# EasyEDA schematic SCH_FinalThesis.json

## Sheets
1 Main: TITLE: ESP32 Interface; REV: 1.0; Date: 2023-12-31; Sheet: 1/3; Drawn By: Guillem Senabre; Company: NCU, UPC
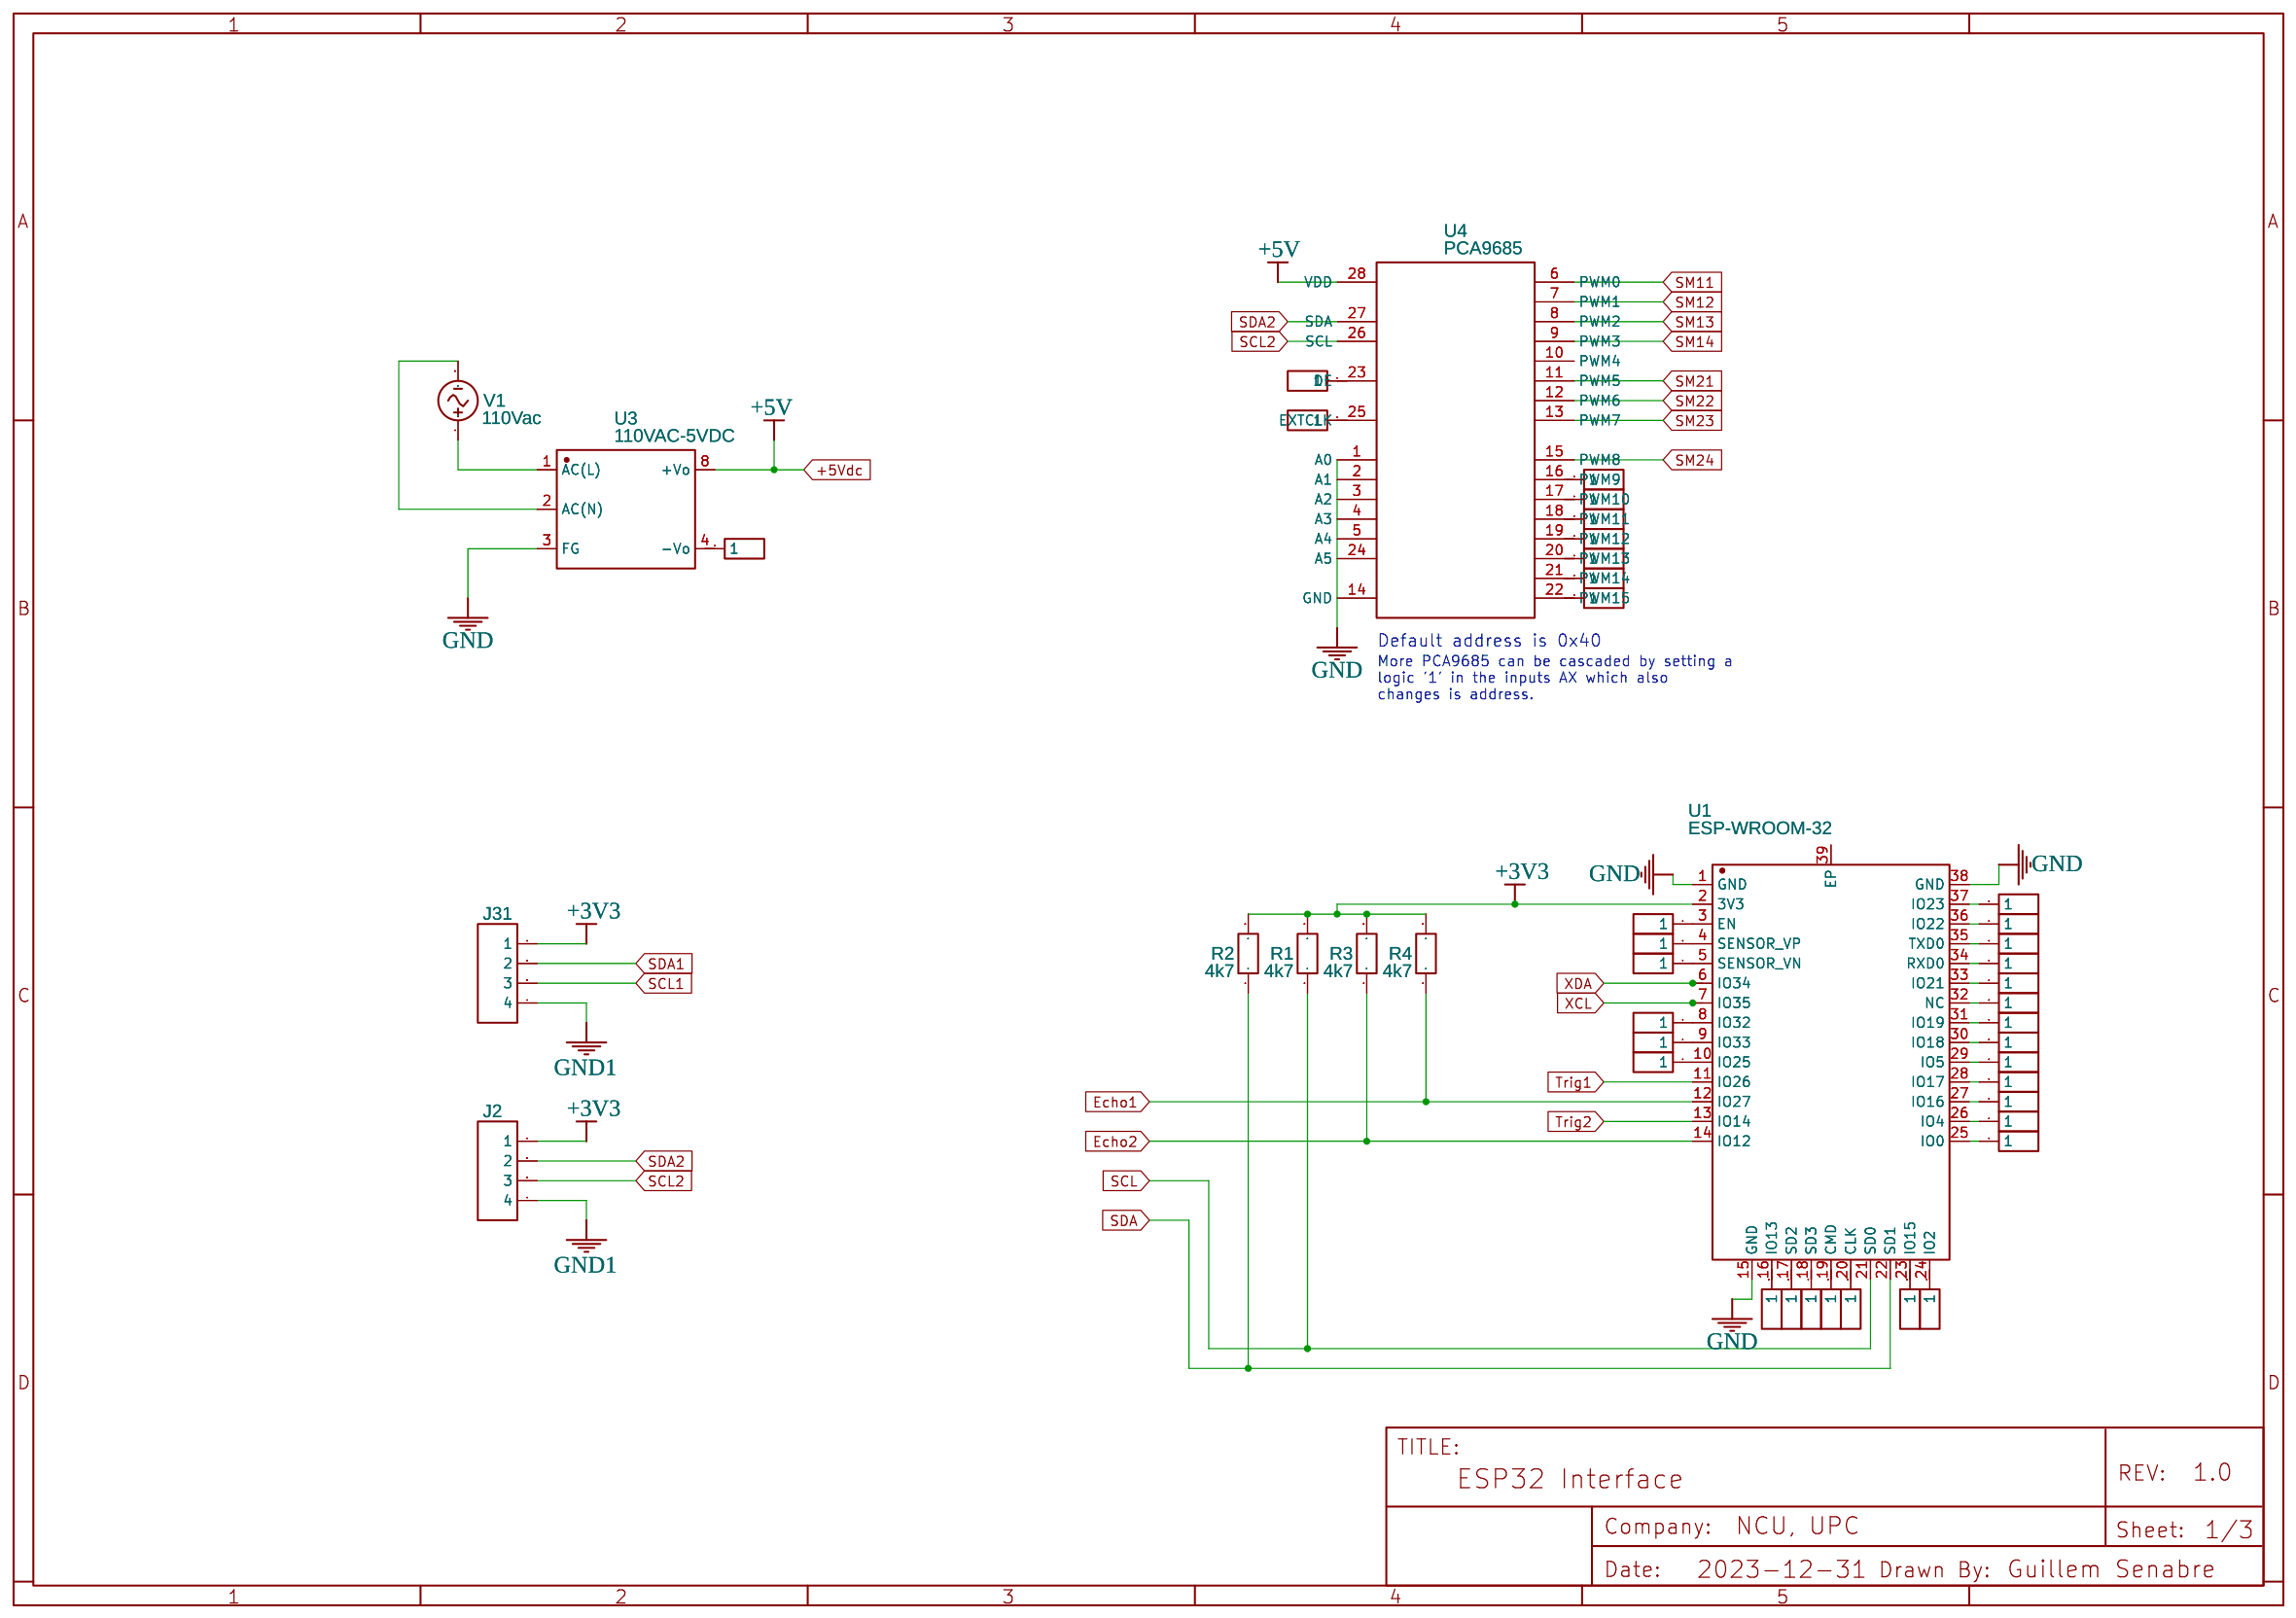
[diagram p0: Main]
2 Sensors: TITLE: Sensors; Sheet: 2/3
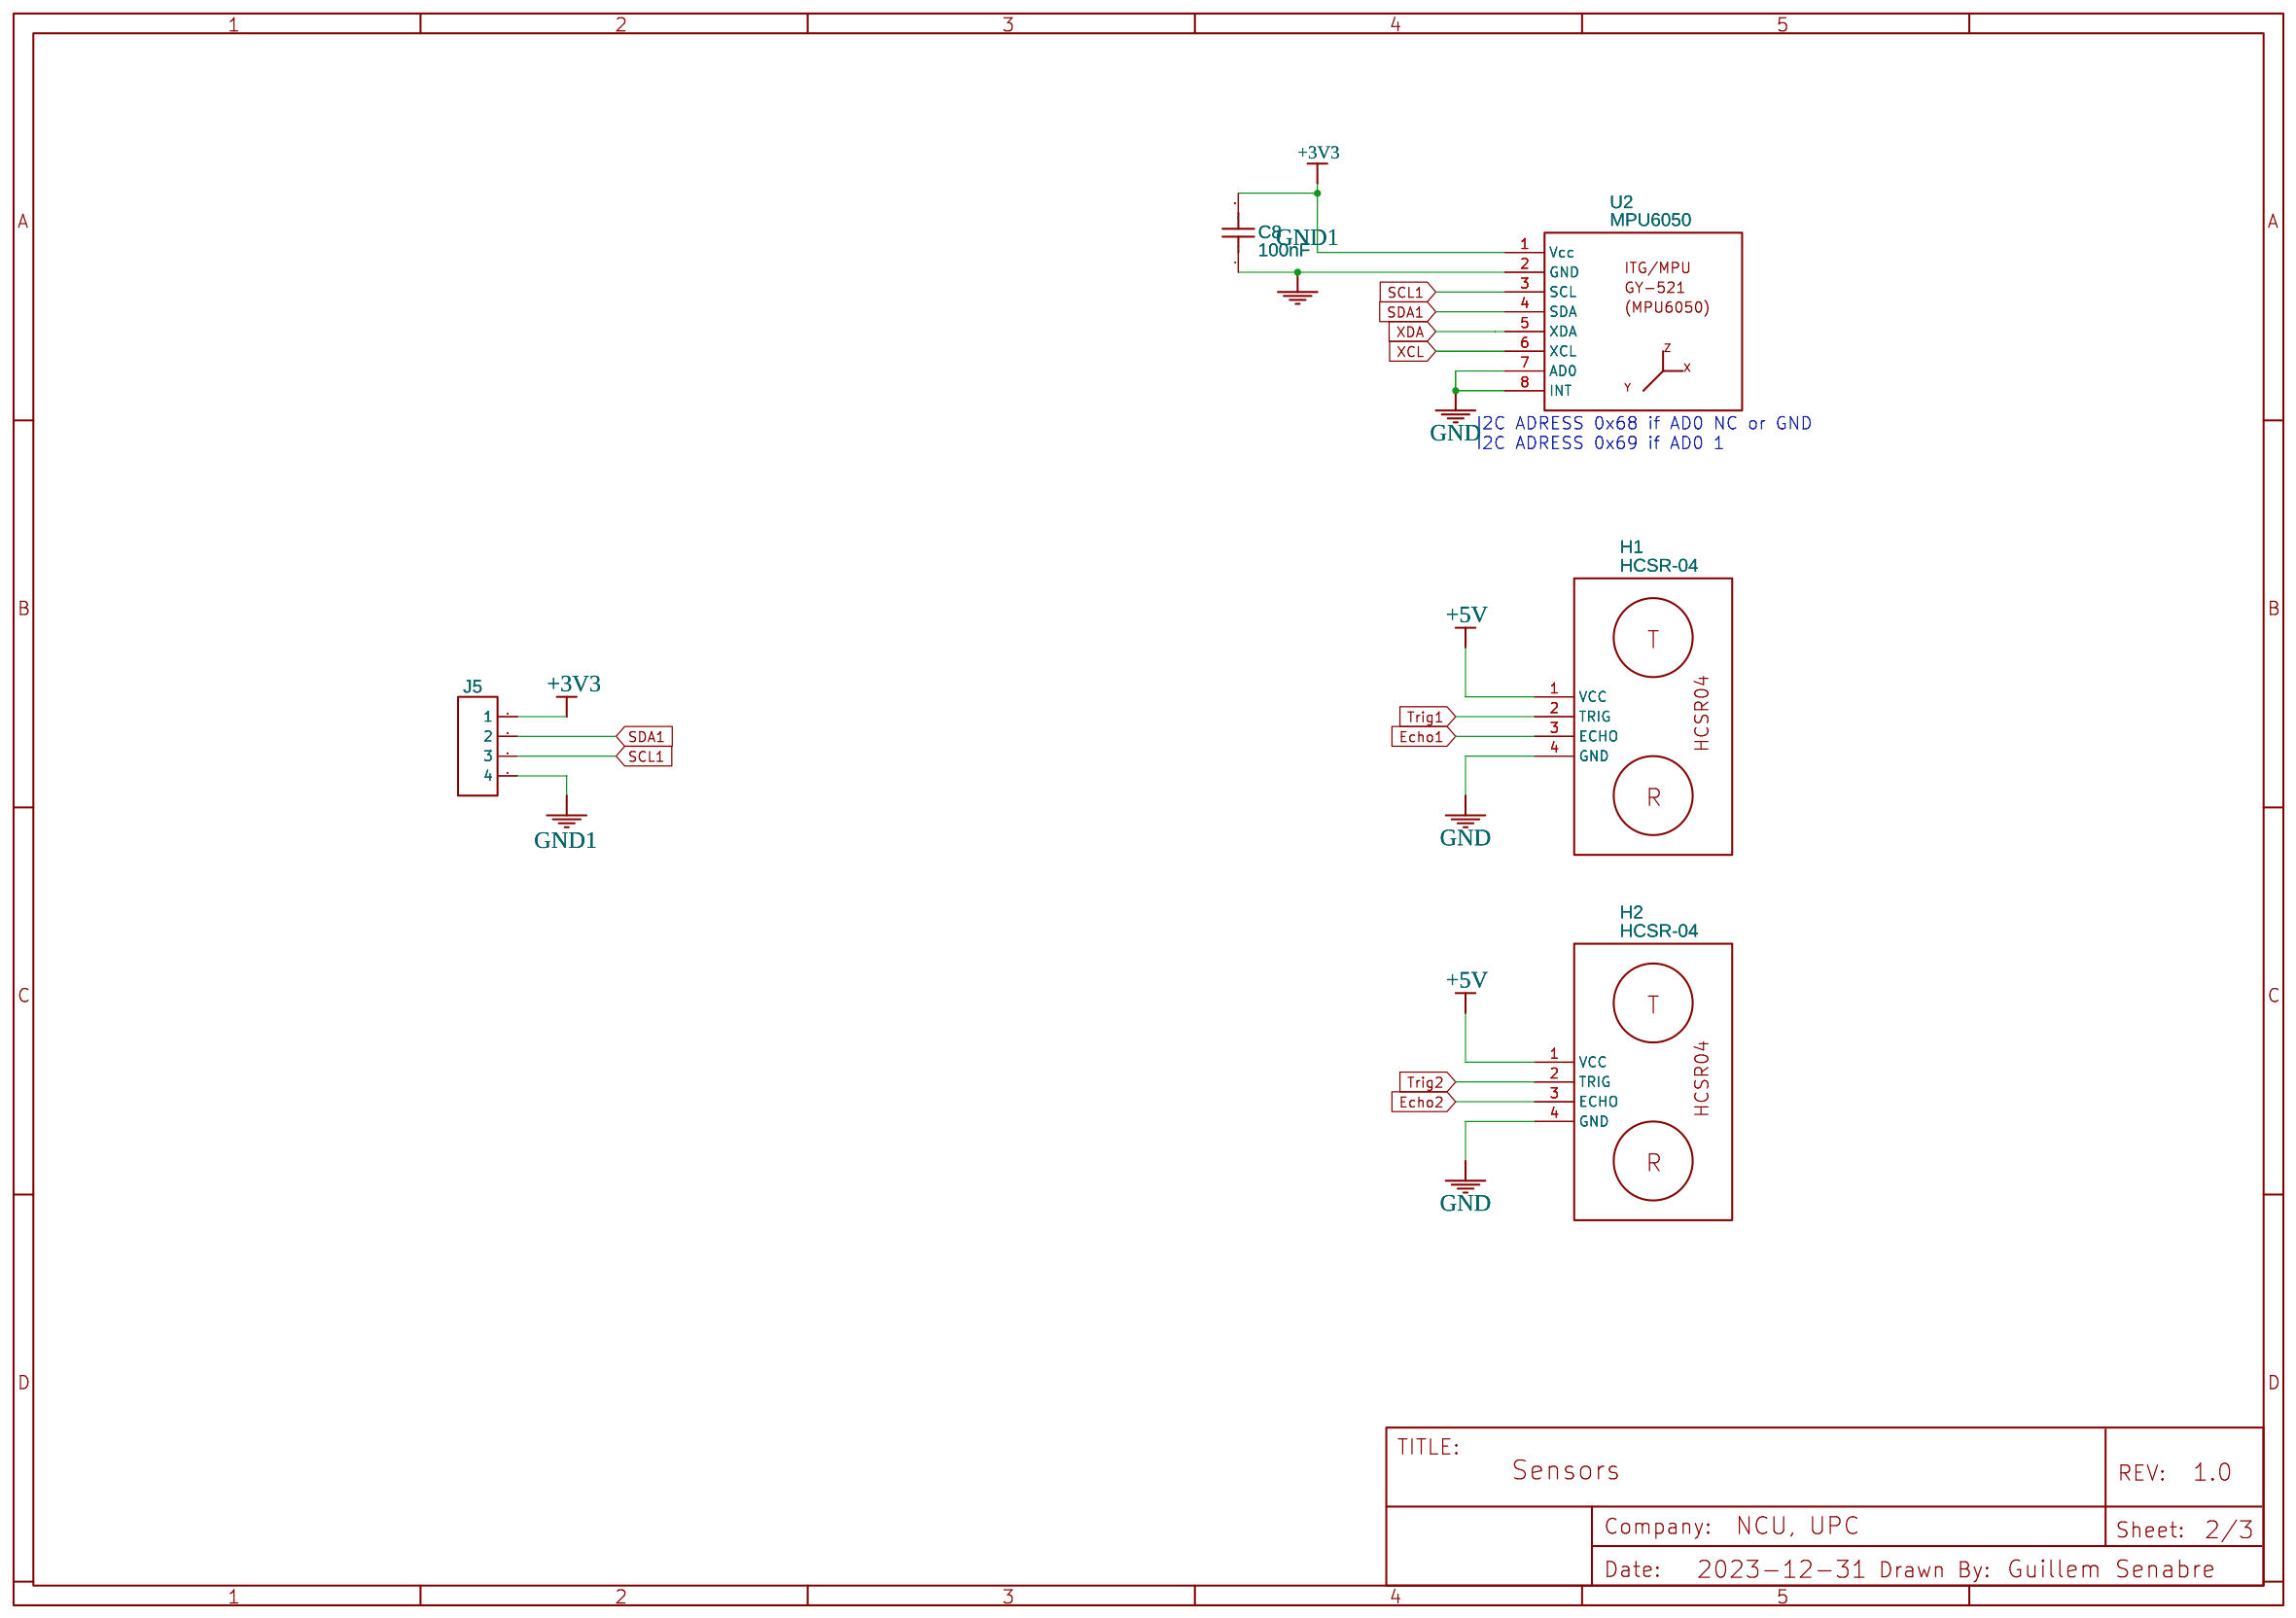
[diagram p1: Sensors]
3 Actuators: TITLE: Servo Motors MG996R; Sheet: 3/3
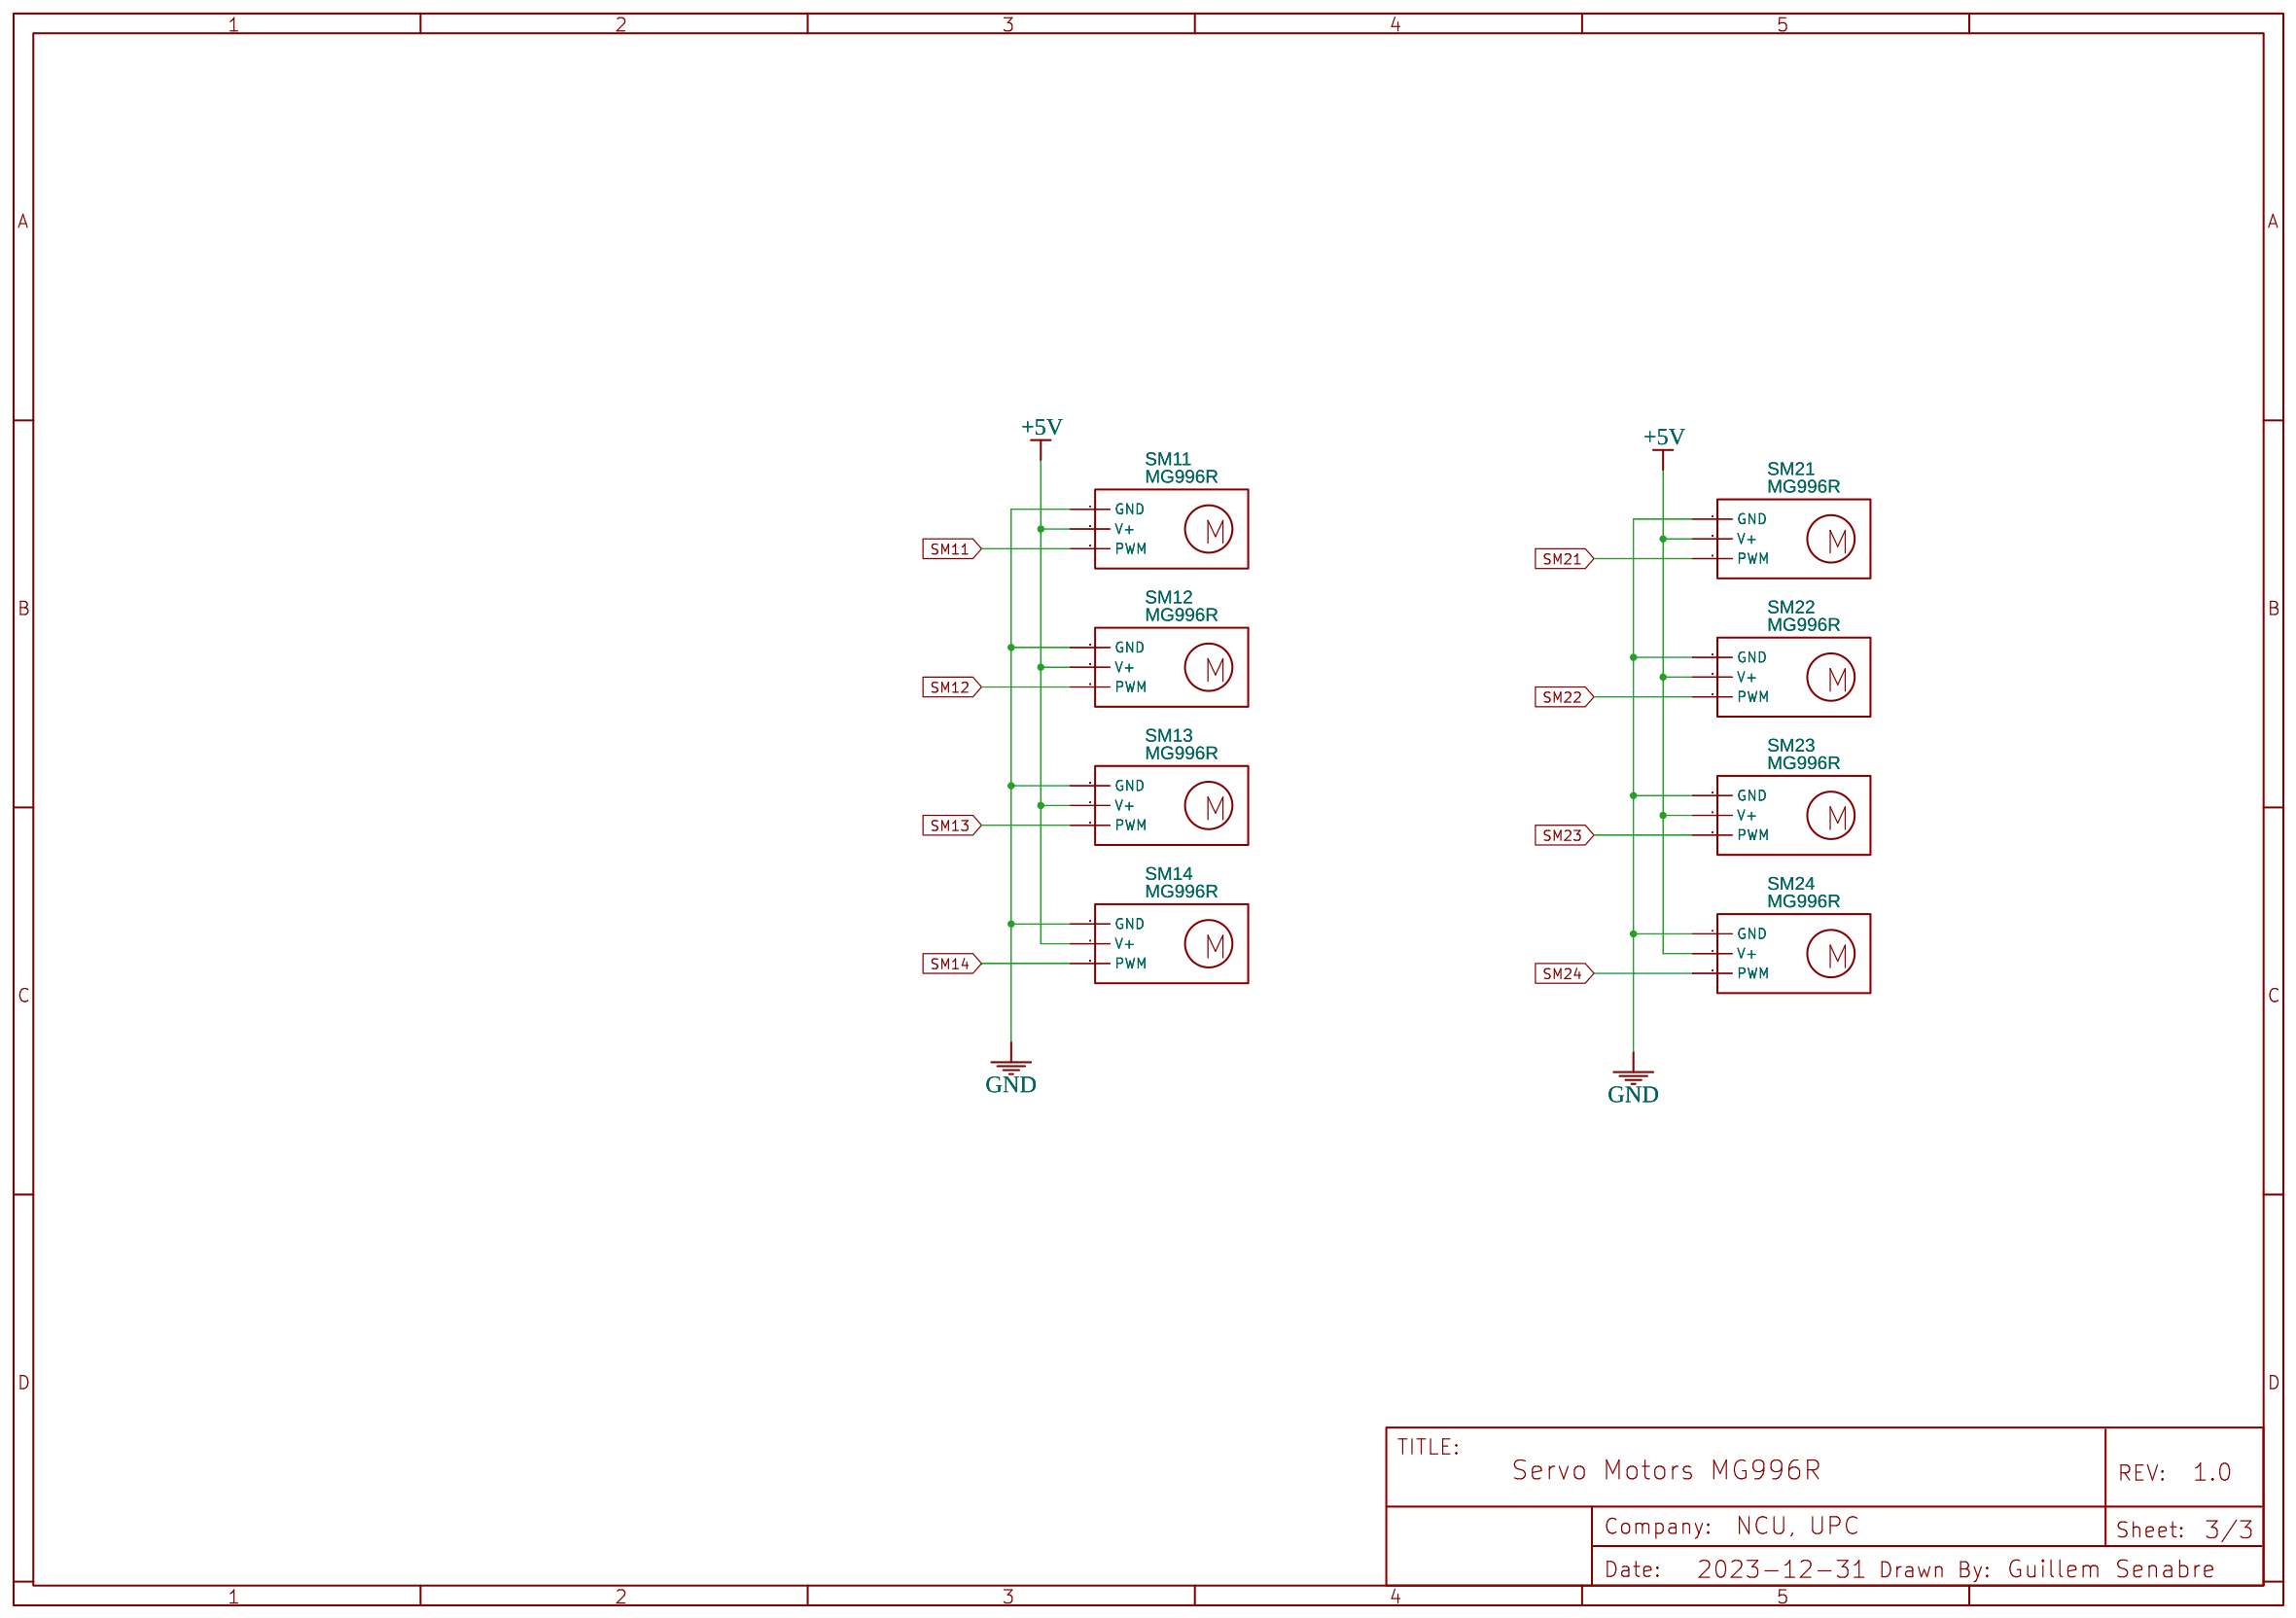
[diagram p2: Actuators]

## Parts
sheet Actuators
SM11  MG996R
SM12  MG996R
SM13  MG996R
SM14  MG996R
SM21  MG996R
SM22  MG996R
SM23  MG996R
SM24  MG996R
sheet Main
J1  HDR-M-2.54_1x1  [HDR-M-2.54_1X1]
J2  HDR-M-2.54_1x4  [HDR-M-2.54_1X4]
J3  HDR-M-2.54_1x1  [HDR-M-2.54_1X1]
J4  HDR-M-2.54_1x1  [HDR-M-2.54_1X1]
J6  HDR-M-2.54_1x1  [HDR-M-2.54_1X1]
J7  HDR-M-2.54_1x1  [HDR-M-2.54_1X1]
J8  HDR-M-2.54_1x1  [HDR-M-2.54_1X1]
J9  HDR-M-2.54_1x1  [HDR-M-2.54_1X1]
J10  HDR-M-2.54_1x1  [HDR-M-2.54_1X1]
J11  HDR-M-2.54_1x1  [HDR-M-2.54_1X1]
J12  HDR-M-2.54_1x1  [HDR-M-2.54_1X1]
J13  HDR-M-2.54_1x1  [HDR-M-2.54_1X1]
J14  HDR-M-2.54_1x1  [HDR-M-2.54_1X1]
J15  HDR-M-2.54_1x1  [HDR-M-2.54_1X1]
J16  HDR-M-2.54_1x1  [HDR-M-2.54_1X1]
J17  HDR-M-2.54_1x1  [HDR-M-2.54_1X1]
J18  HDR-M-2.54_1x1  [HDR-M-2.54_1X1]
J20  HDR-M-2.54_1x1  [HDR-M-2.54_1X1]
J21  HDR-M-2.54_1x1  [HDR-M-2.54_1X1]
J23  HDR-M-2.54_1x1  [HDR-M-2.54_1X1]
J24  HDR-M-2.54_1x1  [HDR-M-2.54_1X1]
J25  HDR-M-2.54_1x1  [HDR-M-2.54_1X1]
J26  HDR-M-2.54_1x1  [HDR-M-2.54_1X1]
J27  HDR-M-2.54_1x1  [HDR-M-2.54_1X1]
J28  HDR-M-2.54_1x1  [HDR-M-2.54_1X1]
J29  HDR-M-2.54_1x1  [HDR-M-2.54_1X1]
J30  HDR-M-2.54_1x1  [HDR-M-2.54_1X1]
J31  HDR-M-2.54_1x4  [HDR-M-2.54_1X4]
J32  HDR-M-2.54_1x1  [HDR-M-2.54_1X1]
J33  HDR-M-2.54_1x1  [HDR-M-2.54_1X1]
J34  HDR-M-2.54_1x1  [HDR-M-2.54_1X1]
J35  HDR-M-2.54_1x1  [HDR-M-2.54_1X1]
J36  HDR-M-2.54_1x1  [HDR-M-2.54_1X1]
J37  HDR-M-2.54_1x1  [HDR-M-2.54_1X1]
J38  HDR-M-2.54_1x1  [HDR-M-2.54_1X1]
J39  HDR-M-2.54_1x1  [HDR-M-2.54_1X1]
J40  HDR-M-2.54_1x1  [HDR-M-2.54_1X1]
J42  HDR-M-2.54_1x1  [HDR-M-2.54_1X1]
R1  4k7  [R0603]
R2  4k7  [R0603]
R3  4k7  [R0603]
R4  4k7  [R0603]
U1  ESP-WROOM-32  [WIFIM-SMD_ESP-WROOM-32]
U3  110VAC-5VDC  [PWRM-TH_ZLG_ZY0JGBXXCD-10W]
U4  PCA9685  [TSSOP-28_L9.7-W4.4-P0.65-LS6.4-BL]
V1  110Vac  [HDR1X2]
sheet Sensors
C8  100nF  [C1206]
H1  HCSR-04  [HCSR-04]
H2  HCSR-04  [HCSR-04]
J5  HDR-M-2.54_1x4  [HDR-M-2.54_1X4]
U2  MPU6050  [GY-521]

## Library data of the parts
SM11-SM14 SM21-SM24 = MG996R: Manufacturer Part: tawaninnovation; Contributor: tawandawei
J1 J3 J4 J6-J18 J20 J21 J23-J30 J32-J40 J42 = HDR-M-2.54_1x1: Supplier Part: C81276; Supplier: LCSC; Contributor: LCEDA_Lib
J2 J5 J31 = HDR-M-2.54_1x4: Supplier Part: C124378; Supplier: LCSC; Contributor: LCEDA_Lib
R1-R4 = R_0603_EU: Contributor: LCEDA_Lib
U1 = ESP-WROOM-32: Supplier: LCSC; Manufacturer: ESPRESSIF(乐鑫); Manufacturer Part: ESP32-WROOM-32; Supplier Part: C95209; JLCPCB Part Class: Extended Part
U3 = ZY0JGB12CD-10W: Contributor: LCSC; Supplier: LCSC; Supplier Part: C135893; Manufacturer: ZLG(致远电子)
U4 = PCA9685: catid: 20; link: https://cdn-shop.adafruit.com/datasheets/PCA9685.pdf; Contributor: jopagti; Manufacturer: NXP Semiconductors; sim: true
V1 = VSin: Contributor: EasyEDA; sim: true
C8 = 1206B104K500: Supplier: LCSC; Manufacturer: WTC; Supplier Part: C93194
H1 H2 = HCSR-04
U2 = GY-521: Contributor: Юрий Владимирович (Duck Duck)

## Nets
+3V3: C8.2 J2.1 J5.1 J31.1 R1.2 R2.2 R3.2 R4.2 U1.2(3V3) U2.1(Vcc)
+5V: H1.1(VCC) H2.1(VCC) SM11.2(V+) SM12.2(V+) SM13.2(V+) SM14.2(V+) SM21.2(V+) SM22.2(V+) SM23.2(V+) SM24.2(V+) U3.8(+Vo)
GND: H1.4(GND) H2.4(GND) SM11.1(GND) SM12.1(GND) SM13.1(GND) SM14.1(GND) SM21.1(GND) SM22.1(GND) SM23.1(GND) SM24.1(GND) U1.1(GND) U1.15(GND) U1.38(GND) U2.7(AD0) U2.8(INT) U3.3(FG)
GND1: C8.1 J2.4 J5.4 J31.4 U2.2(GND)
Echo1: H1.3(ECHO) R4.1 U1.12(IO27)
Echo2: H2.3(ECHO) R3.1 U1.14(IO12)
SCL: R1.1 U1.21(SD0)
SCL1: J5.3 J31.3 U2.3(SCL)
SCL2: J2.3
SDA: R2.1 U1.22(SD1)
SDA1: J5.2 J31.2 U2.4(SDA)
SDA2: J2.2
SM11: SM11.3(PWM)
SM12: SM12.3(PWM)
SM13: SM13.3(PWM)
SM14: SM14.3(PWM)
SM21: SM21.3(PWM)
SM22: SM22.3(PWM)
SM23: SM23.3(PWM)
SM24: SM24.3(PWM)
Trig1: H1.2(TRIG) U1.11(IO26)
Trig2: H2.2(TRIG) U1.13(IO14)
XCL: U1.7(IO35) U2.6(XCL)
XDA: U1.6(IO34) U2.5(XDA)
Net-(J1-1): J1.1 U1.23(IO15)
Net-(J3-1): J3.1 U1.3(EN)
Net-(J4-1): J4.1 U1.4(SENSOR_VP)
Net-(J6-1): J6.1 U1.5(SENSOR_VN)
Net-(J7-1): J7.1 U1.9(IO33)
Net-(J8-1): J8.1 U1.10(IO25)
Net-(J9-1): J9.1 U1.8(IO32)
Net-(J10-1): J10.1 U3.4(-Vo)
Net-(J11-1): J11.1 U1.34(RXD0)
Net-(J12-1): J12.1 U1.35(TXD0)
Net-(J13-1): J13.1 U1.37(IO23)
Net-(J14-1): J14.1 U1.36(IO22)
Net-(J15-1): J15.1 U1.32(NC)
Net-(J16-1): J16.1 U1.33(IO21)
Net-(J17-1): J17.1 U1.31(IO19)
Net-(J18-1): J18.1 U1.30(IO18)
Net-(J23-1): J23.1 U1.26(IO4)
Net-(J24-1): J24.1 U1.27(IO16)
Net-(J25-1): J25.1 U1.29(IO5)
Net-(J26-1): J26.1 U1.28(IO17)
Net-(J27-1): J27.1 U1.25(IO0)
Net-(J28-1): J28.1 U1.18(SD3)
Net-(J29-1): J29.1 U1.19(CMD)
Net-(J30-1): J30.1 U1.17(SD2)
Net-(J39-1): J39.1 U1.16(IO13)
Net-(J40-1): J40.1 U1.20(CLK)
Net-(J42-1): J42.1 U1.24(IO2)
Net-(U3-1): U3.1(AC(L)) V1.1
Net-(U3-2): U3.2(AC(N)) V1.2

Not connected (* = marked no-connect by the designer): J20 1; J21 1; J32 1; J33 1; J34 1; J35 1; J36 1; J37 1; J38 1; U1 39(EP); U4 1(A0) 2(A1) 3(A2) 4(A3) 5(A4) 6(PWM0) 7(PWM1) 8(PWM2) 9(PWM3) 10(PWM4) 11(PWM5) 12(PWM6) 13(PWM7) 14(GND) 15(PWM8) 16(PWM9) 17(PWM10) 18(PWM11) 19(PWM12) 20(PWM13) 21(PWM14) 22(PWM15) 23(DE) 24(A5) 25(EXTCLK) 26(SCL) 27(SDA) 28(VDD)

## Notes on the sheets
sheet 1
- Default address is 0x40
- More PCA9685 can be cascaded by setting a
  logic '1' in the inputs AX which also
  changes is address.
sheet 2
- I2C ADRESS 0x68 if AD0 NC or GND
- I2C ADRESS 0x69 if AD0 1
